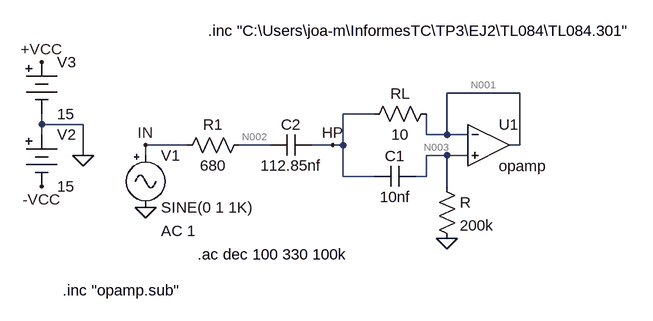
[diagram p0: schematic gyrator.asc]
gyrator.asc, the LTspice schematic file:
Version 4
SHEET 1 880 680
WIRE 192 80 80 80
WIRE -32 112 -80 112
WIRE -544 128 -544 112
WIRE -480 128 -544 128
WIRE -544 144 -544 128
WIRE 48 144 48 112
WIRE 80 144 80 80
WIRE 80 144 48 144
WIRE 112 144 80 144
WIRE -320 160 -384 160
WIRE -192 160 -240 160
WIRE -96 160 -128 160
WIRE -80 160 -80 112
WIRE -80 160 -96 160
WIRE 192 160 192 80
WIRE 192 160 176 160
WIRE -480 176 -480 128
WIRE -384 176 -384 160
WIRE 80 176 48 176
WIRE 112 176 80 176
WIRE -80 208 -80 160
WIRE -32 208 -80 208
WIRE 48 208 48 176
WIRE 48 208 32 208
WIRE 80 224 80 176
FLAG 80 304 0
FLAG -384 256 0
FLAG -544 32 +VCC
FLAG -544 224 -VCC
FLAG -480 176 0
FLAG -96 160 HP
FLAG -384 160 IN
SYMBOL res 64 96 R90
WINDOW 0 0 56 VBottom 2
WINDOW 3 32 56 VTop 2
SYMATTR InstName RL
SYMATTR Value 10
SYMBOL res 64 208 R0
SYMATTR InstName R
SYMATTR Value 200k
SYMBOL cap 32 192 R90
WINDOW 0 0 32 VBottom 2
WINDOW 3 32 32 VTop 2
SYMATTR InstName C1
SYMATTR Value 10nf
SYMBOL res -224 144 R90
WINDOW 0 0 56 VBottom 2
WINDOW 3 32 56 VTop 2
SYMATTR InstName R1
SYMATTR Value 680
SYMBOL cap -128 144 R90
WINDOW 0 0 32 VBottom 2
WINDOW 3 32 32 VTop 2
SYMATTR InstName C2
SYMATTR Value 112.85nf
SYMBOL Misc\\signal -384 160 R0
WINDOW 123 24 132 Left 2
WINDOW 39 0 0 Left 0
SYMATTR Value2 AC 1
SYMATTR InstName V1
SYMBOL Misc\\battery -544 128 R0
WINDOW 123 0 0 Left 0
WINDOW 39 0 0 Left 0
SYMATTR InstName V2
SYMATTR Value 15
SYMBOL Misc\\battery -544 16 R0
WINDOW 123 0 0 Left 0
WINDOW 39 0 0 Left 0
SYMATTR InstName V3
SYMATTR Value 15
SYMBOL Opamps\\opamp 144 96 R0
SYMATTR InstName U1
TEXT -304 328 Left 2 !.ac dec 100 330 100k
TEXT -288 -16 Left 2 !.inc "C:\\Users\\joa-m\\InformesTC\\TP3\\EJ2\\TL084\\TL084.301"
TEXT -512 384 Left 2 !.inc "opamp.sub"

The netlist it stands for:
* gyrator.asc
RL N001 HP 10
R N003 0 200k
C1 N003 HP 10nf
R1 N002 IN 680
C2 HP N002 112.85nf
V1 IN 0 SINE(0 1 1K) AC 1
V2 0 -VCC 15
V3 +VCC 0 15
XU1 N001 N003 N001 opamp Aol=100K GBW=10Meg  ; pins invin noninvin out
.ac dec 100 330 100k
.inc "C:\Users\joa-m\InformesTC\TP3\EJ2\TL084\TL084.301"
.inc "opamp.sub"
.backanno
.end

* Results of the author's LTspice run, read from the files saved beside the schematic
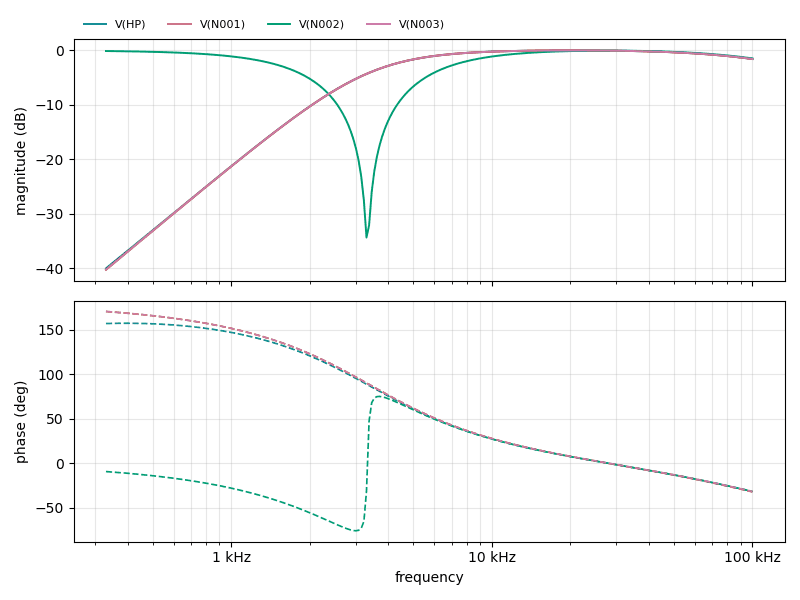
[diagram p1: AC Analysis of gyrator.asc, plotted from the saved traces]
* AC Analysis, 1 run:
*   V(HP): -40.04 dB at 330 Hz, -1.58 dB at 100 kHz, peak -0.00 dB at 20.35 kHz, 3 dB below the peak at 3.89 kHz
*   V(N001): -40.29 dB at 330 Hz, -1.58 dB at 100 kHz, peak -0.00 dB at 20.35 kHz, 3 dB below the peak at 3.891 kHz
*   V(N002): -0.11 dB at 330 Hz, -1.47 dB at 100 kHz, peak -0.04 dB at 28.09 kHz, 3 dB below the peak at 6.739 kHz
*   V(N003): -40.29 dB at 330 Hz, -1.58 dB at 100 kHz, peak -0.00 dB at 20.35 kHz, 3 dB below the peak at 3.891 kHz